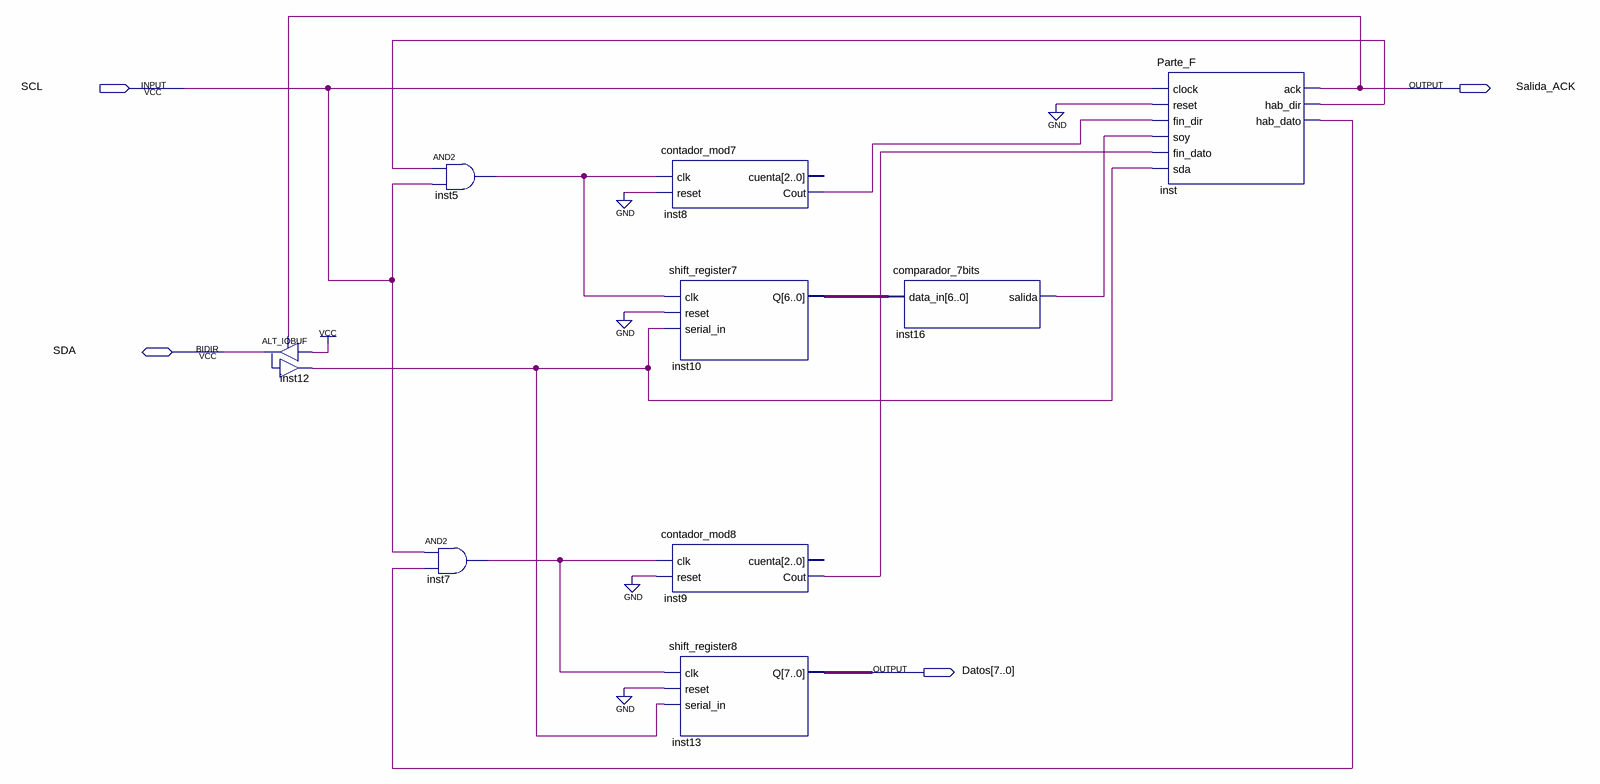
[diagram p0: schematic sheet]
// Quartus schematic Diagrama_de_bloques.bdf as structural Verilog: 9 symbols, 4 pins
module Diagrama_de_bloques (
  input  SCL,
  inout  SDA,
  output Salida_ACK,
  output [7:0] Datos
);

  wire inst5_out, inst7_out, inst8_cout, inst9_cout, inst12_o, inst16_salida, inst_hab_dato, inst_hab_dir;
  wire [6:0] inst10_q;

  ALT_IOBUF inst12 (.i(1'b1), .oe(Salida_ACK), .o(inst12_o), .io(SDA));
  and inst5 (inst5_out, inst_hab_dir, SCL);
  and inst7 (inst7_out, SCL, inst_hab_dato);
  contador_mod7 inst8 (.clk(inst5_out), .reset(1'b0), .Cout(inst8_cout));  // open: cuenta
  shift_register7 inst10 (.clk(inst5_out), .reset(1'b0), .serial_in(inst12_o), .Q(inst10_q));
  contador_mod8 inst9 (.clk(inst7_out), .reset(1'b0), .Cout(inst9_cout));  // open: cuenta
  shift_register8 inst13 (.clk(inst7_out), .reset(1'b0), .serial_in(inst12_o), .Q(Datos));
  comparador_7bits inst16 (.data_in(inst10_q), .salida(inst16_salida));
  Parte_F inst (
    .clock(SCL), .reset(1'b0), .fin_dir(inst8_cout), .soy(inst16_salida), .fin_dato(inst9_cout),
    .sda(inst12_o), .ack(Salida_ACK), .hab_dir(inst_hab_dir), .hab_dato(inst_hab_dato));
endmodule
